# EAGLE design unijoysticle (EAGLE 7.7.0)
CNAME: Retro Moe; CREVISION: 0.4.1; DESIGNER: Ricardo Quesada
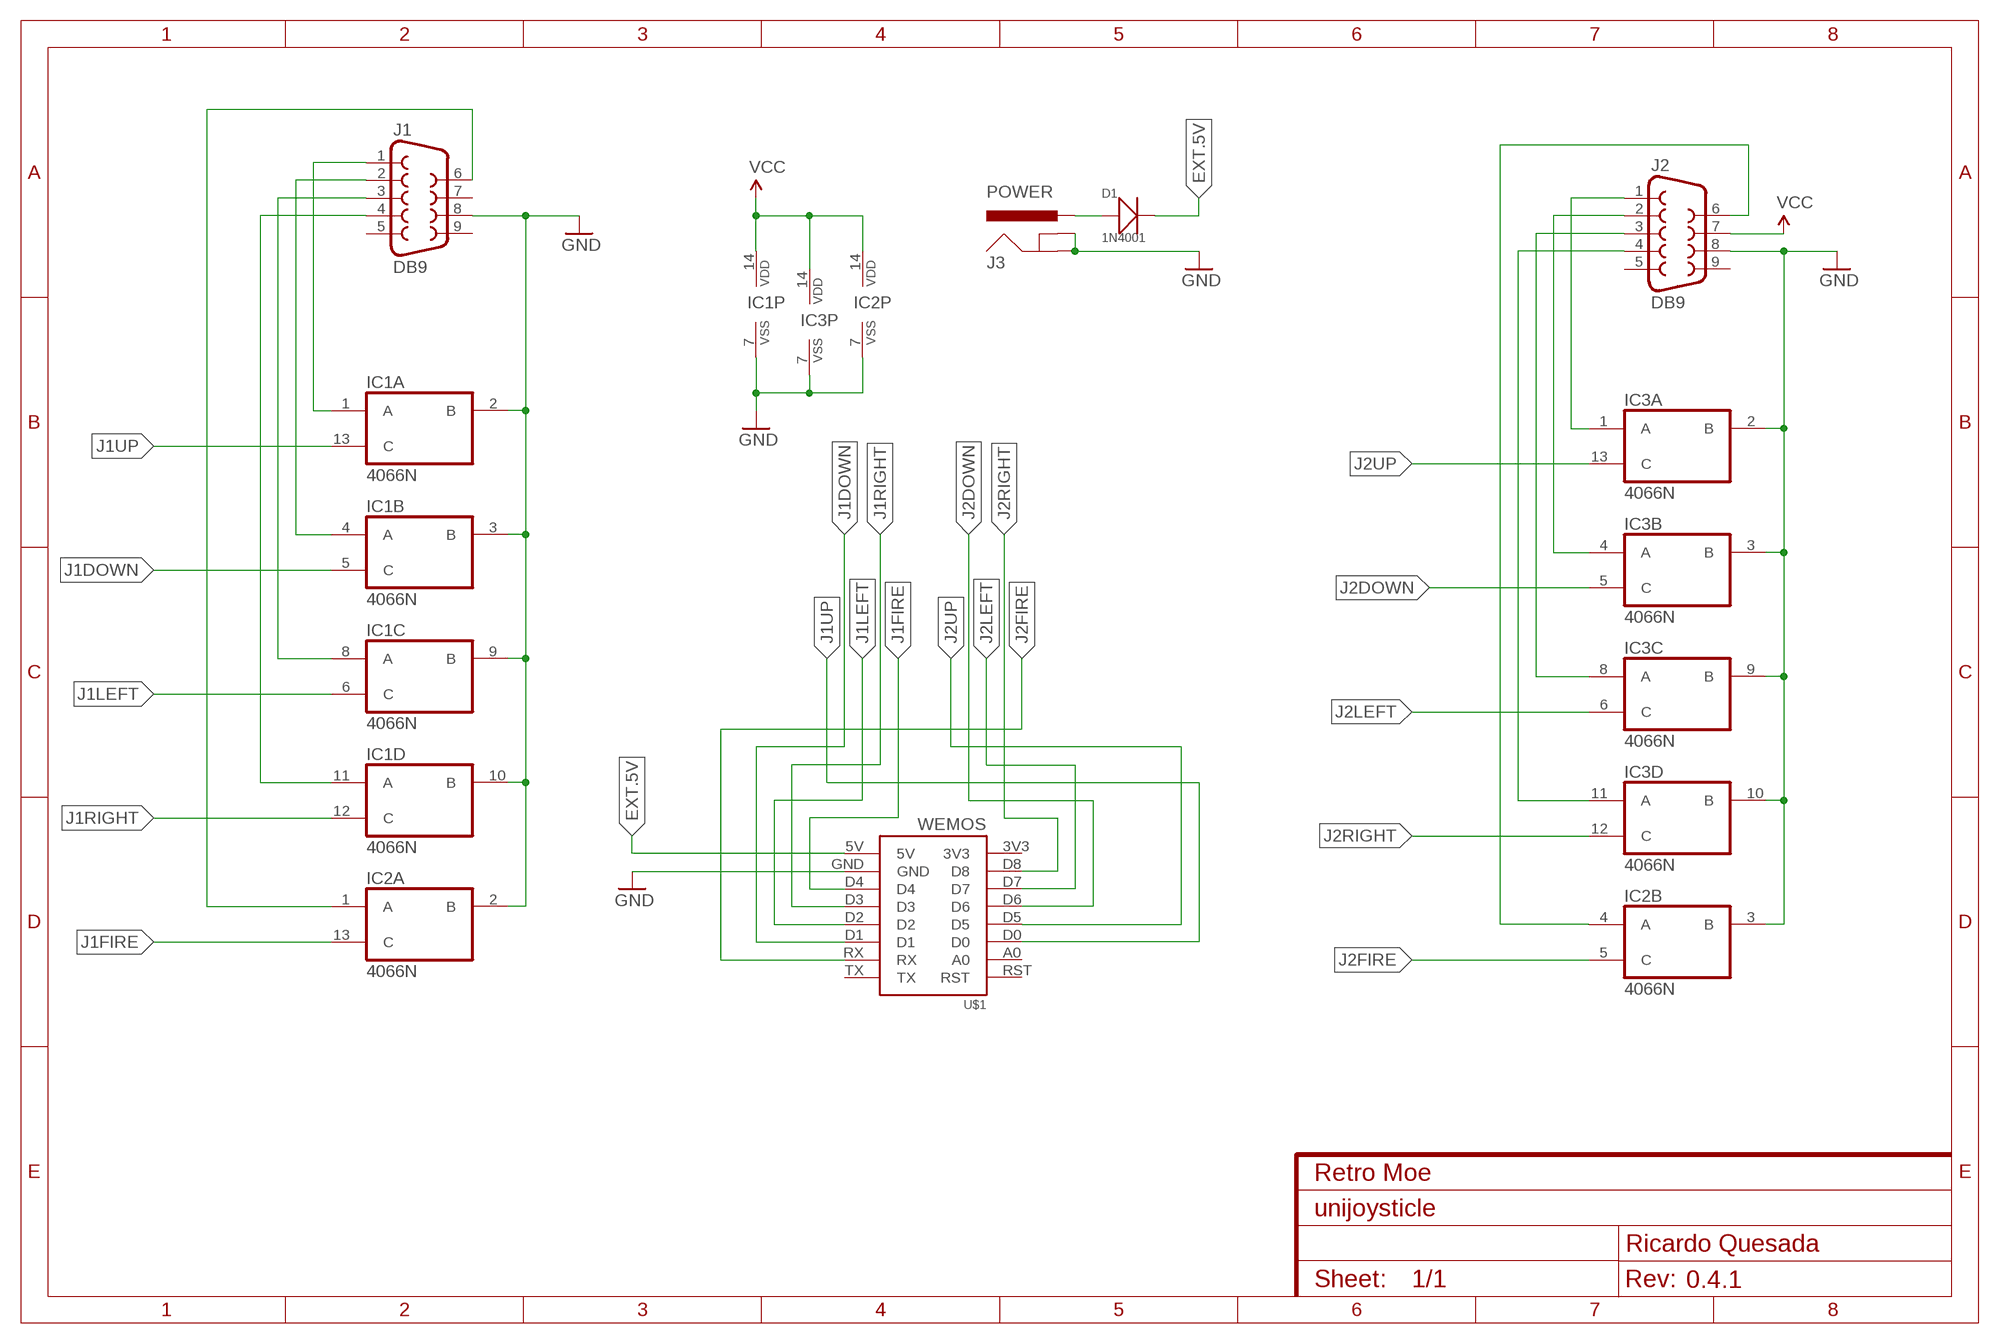
[diagram p0: schematic, sheet 1]

## Parts
D1  1N4001  DIP-DIODE-50V-1A-1N4001(DO-41)  [DO-41]
IC1  4066N  [DIL14]
IC2  4066N  [DIL14]
IC3  4066N  [DIL14]
J1  DB9  DB9FEMALE  [DB9]
J2  DB9  DB9FEMALE  [DB9]
J3  POWER  POWER_JACKSLT  [POWER_JACK_SLOT]
U$1  WEMOS  [WEMOS]

## Nets
EXT.5V: D1.2(-) U$1.5V
GND: IC1.2(A:B) IC1.3(B:B) IC1.7(P:VSS) IC1.9(C:B) IC1.10(D:B) IC2.2(A:B) IC2.3(B:B) IC2.7(P:VSS) IC3.2(A:B) IC3.3(B:B) IC3.7(P:VSS) IC3.9(C:B) IC3.10(D:B) J1.8 J2.8 J3.GND@1(GNDBREAK) J3.GND@2(GND) U$1.GND
J1DOWN: IC1.5(B:C) U$1.D1
J1FIRE: IC2.13(A:C) U$1.D4
J1LEFT: IC1.6(C:C) U$1.D2
J1RIGHT: IC1.12(D:C) U$1.D3
J1UP: IC1.13(A:C) U$1.D0
J2DOWN: IC3.5(B:C) U$1.D6
J2FIRE: IC2.5(B:C) U$1.RX
J2LEFT: IC3.6(C:C) U$1.D7
J2RIGHT: IC3.12(D:C) U$1.D8
J2UP: IC3.13(A:C) U$1.D5
N$1: D1.1(+) J3.PWR
N$9: IC1.1(A:A) J1.1
N$10: IC1.4(B:A) J1.2
N$11: IC1.8(C:A) J1.3
N$12: IC1.11(D:A) J1.4
N$13: IC3.1(A:A) J2.1
N$14: IC3.4(B:A) J2.2
N$15: IC3.8(C:A) J2.3
N$16: IC3.11(D:A) J2.4
N$21: IC2.1(A:A) J1.6
N$22: IC2.4(B:A) J2.6
VCC: IC1.14(P:VDD) IC2.14(P:VDD) IC3.14(P:VDD) J2.7
Unconnected: IC2.6(C:C) IC2.8(C:A) IC2.9(C:B) IC2.10(D:B) IC2.11(D:A) IC2.12(D:C) J1.5 J1.7 J1.9 J2.5 J2.9 U$1.3V3 U$1.A0 U$1.RST U$1.TX

## Library data of the parts
D1 = Seeed-OPL-Diode:DIP-DIODE-50V-1A-1N4001(DO-41): 304010006; MPN: 1N4001
IC1-IC3 = 40xx:4066: Quad bilateral ANALOG SWITCH; MF: TEXAS INSTRUMENTS; MPN: SN74HC4066N; OC_NEWARK: 76C3574
J1 J2 = riq-connectors:DB9: DB9 Connector Standard DB9 (D-Sub 9) serial connector. Can be used for CAN bus as well as RS485 and RS232. Footprint production proven. Spark Fun Electronics SKU : PRT-00429; MPN: 618009231121; OC_NEWARK: 16T0655; PROD_ID: CONN-08194
J3 = SparkFun-Connectors:POWER_JACK: Power Jack This is the standard 5.5mm barrel jack for power. The PTH is the most common, proven, reliable, footprint. The Slot footprint only works if the mill layer is transmitted to the PCB fab house so be warned. Mating wall wart : TOL-00298 (and others); PROD_ID: PRT-00119
U$1 = 1455413453956-wemos:WEMOS

## Net classes
0 default: width 0.305 mm, drill 0.508 mm, clearance 0.254 mm
1 PWR5: width 0.305 mm, drill 0.508 mm, clearance 0.254 mm

## Board
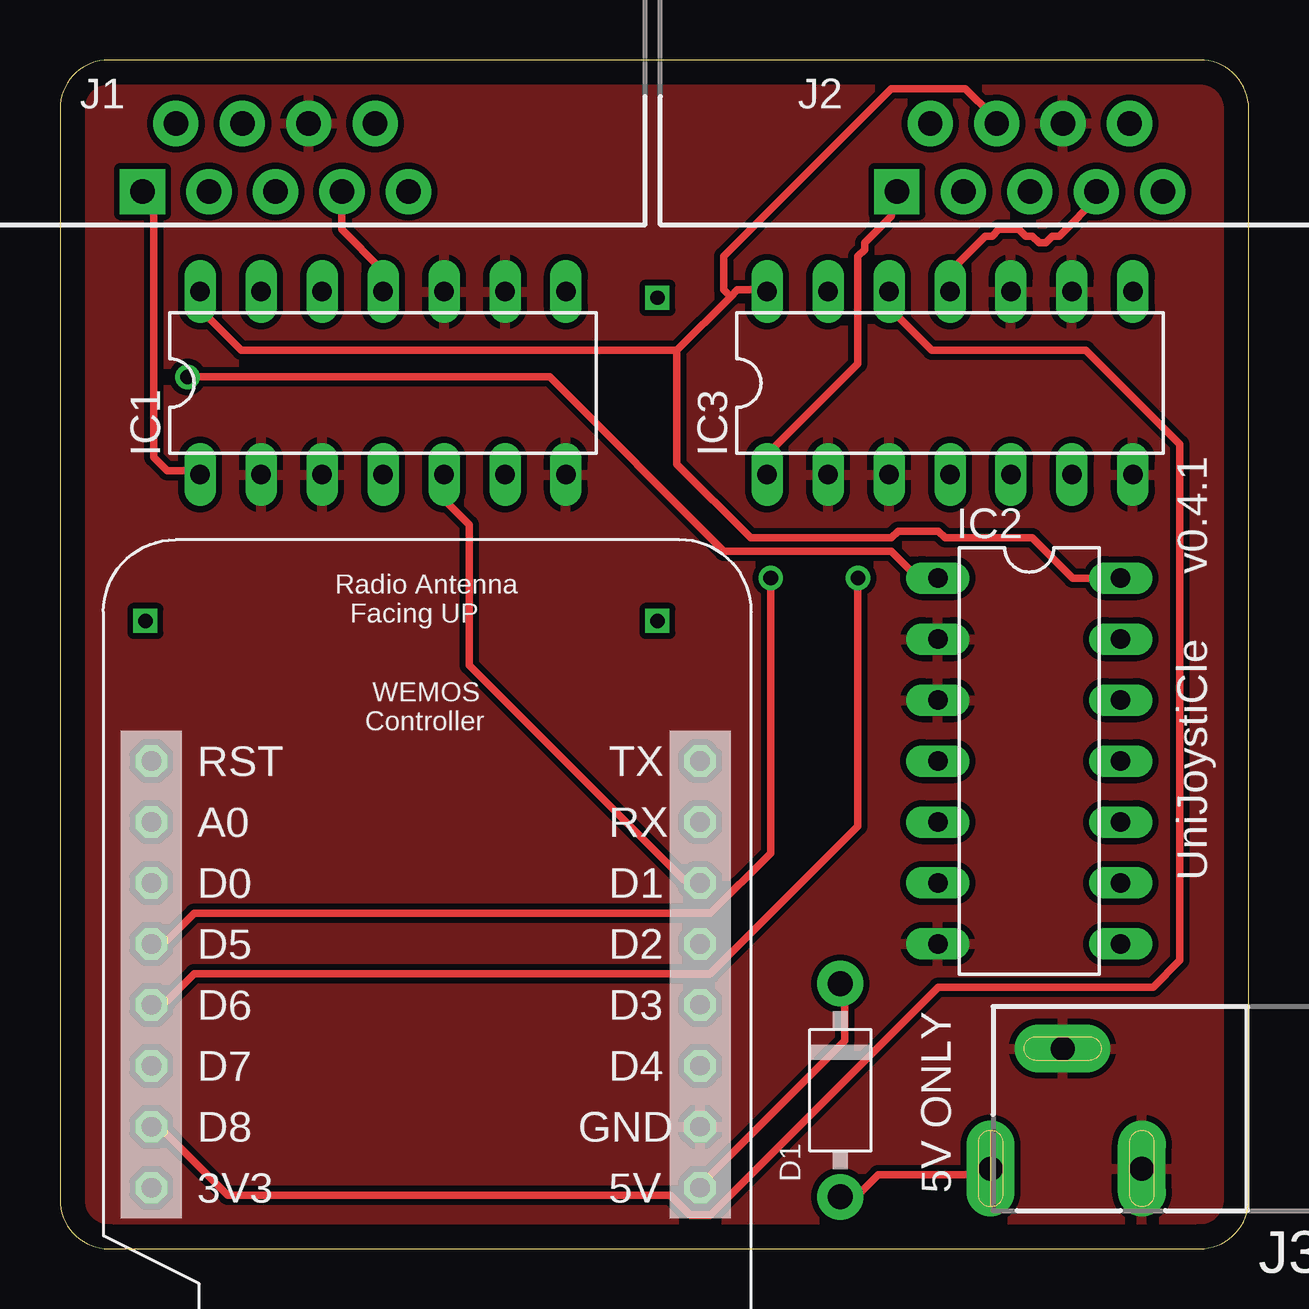
[diagram p1: board, top side]
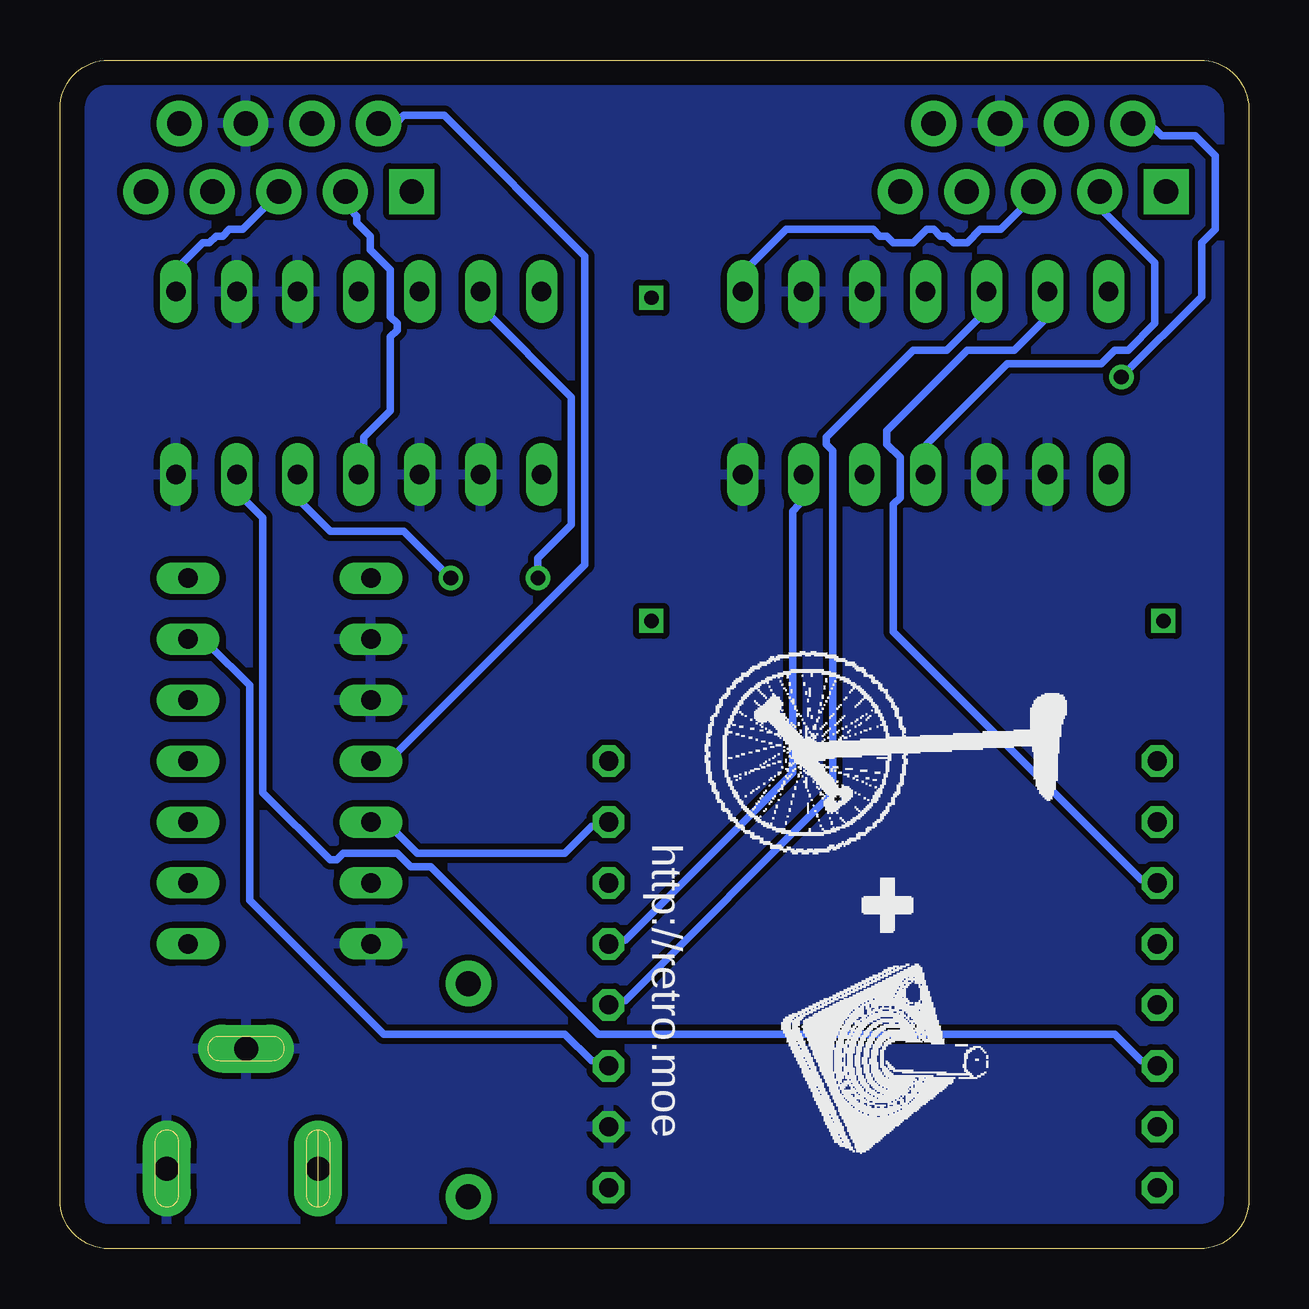
[diagram p2: board, bottom side, seen from below]

Size 49.53 x 49.53 mm. Coordinates in mm from the lower left corner, seen from the top.
Outline: 0,47.5 0,2.03 arc90 2.03,0 47.5,0 arc90 49.53,2.03 49.53,47.5 arc90 47.5,49.53 2.03,49.53 arc90 0,47.5
Copper layers (1*16): Top 0.035mm / dielectric 1.5mm / Bottom 0.035mm
Design rules "default": minimum track width 10mil, minimum drill 24mil, track to track 8mil, track to pad 8mil, pad to pad 8mil, via to via 8mil, smd to smd 8mil, copper to edge 40mil, drill to drill 8mil, minimum pad ring 10mil, minimum via ring 8mil, stop-mask expansion 4mil, vias tented up to drill 0mil, thermal gap 10mil

### Footprints (pad centres in the part's own frame; a part is rotated, then mirrored left to right if it is on the bottom)
DO-41 = drill 1.041 pad 1.905: 1 -4.445,0; 2 4.445,0
DIL14 = drill 0.813 long: 1 -7.62,-3.81; 2 -5.08,-3.81; 3 -2.54,-3.81; 4 0,-3.81; 5 2.54,-3.81; 6 5.08,-3.81; 7 7.62,-3.81; 8 7.62,3.81; 9 5.08,3.81; 10 2.54,3.81; 11 0,3.81; 12 -2.54,3.81; 13 -5.08,3.81; 14 -7.62,3.81
DB9 = drill 1.016 pad 1.88 square: 1 -5.54,-1.42 | drill 1.016 pad 1.88: 2 -2.77,-1.42; 3 0,-1.42; 4 2.77,-1.42; 5 5.54,-1.42; 6 -4.15,1.42; 7 -1.38,1.42; 8 1.38,1.42; 9 4.15,1.42
POWER_JACK_SLOT = drill 1 pad 2 long: GND@1 2.58,7.5; GND@2 7.58,10.8; PWR 2.58,13.8
WEMOS = drill 0.8 octagon: 3V3 0,0; 5V 22.86,0; A0 0,15.24; D0 0,12.7; D1 22.86,12.7; D2 22.86,10.16; D3 22.86,7.62; D4 22.86,5.08; D5 0,10.16; D6 0,7.62; D7 0,5.08; D8 0,2.54; GND 22.86,2.54; RST 0,17.78; RX 22.86,15.24; TX 22.86,17.78

### Placement (x,y rotation side)
D1  32.51,6.6 90 top
IC1  13.46,36.07 0 top
IC2  40.39,20.32 270 top
IC3  37.08,36.07 0 top
J1  8.98,45.47 0 top
J2  40.41,45.47 0 top
J3  52.58,0.76 90 top
U$1  3.81,2.54 0 top

### Tracks (layer width: path | path; a pad name or v marks a point on that pad's centre or on a via)
EXT.5V
  Top 0.305: U$1.5V 26.82,2.79 32.69,8.66 32.69,10.9 D1.2
GND
  pour Top (isolate 0.012): 47.5,0 2.03,0 arc-90 0,2.03 0,47.5 arc-90 2.03,49.53 47.5,49.53 arc-90 49.53,47.5 49.53,2.03 arc-90
  pour Bottom (isolate 0.012): 47.5,0 2.03,0 arc-90 0,2.03 0,47.5 arc-90 2.03,49.53 47.5,49.53 arc-90 49.53,47.5 49.53,2.03 arc-90
J1DOWN
  Top 0.305: U$1.D1 26.54,15.37 25.98,15.37 17.04,24.31 17.04,30.18 16.2,31.01 16.2,32.13 IC1.5
J1FIRE
  Bottom 0.305: U$1.D4 26.82,7.82 27.38,7.82 28.5,8.94 36.04,8.94 41.63,14.53 41.63,23.47 43.31,25.15 44.15,25.15 IC2.13
J1LEFT
  Bottom 0.305: U$1.D2 26.54,12.85 25.98,12.85 19,19.84 19,30.73 18.72,31.01 18.72,32.13 IC1.6
J1RIGHT
  Bottom 0.305: U$1.D3 26.54,10.34 25.98,10.34 17.32,19 17.32,33.25 17.6,33.53 17.6,33.81 13.97,37.44 12.57,37.44 11.18,38.84 11.18,39.67 IC1.12
J1UP
  Bottom 0.305: IC1.13 8.38,38.84 9.78,37.44 11.73,37.44 15.09,34.09 15.09,33.53 14.53,32.97 14.53,31.29 14.81,31.01 14.81,25.7 4.47,15.37 3.91,15.37 U$1.D0
J2DOWN  (via drill 0.61)
  Top 0.305: v33.25,27.94 33.25,17.6 27.1,11.46 5.59,11.46 4.47,10.34 3.91,10.34 U$1.D6
  Bottom 0.305: v33.25,27.94 35.2,29.9 38.28,29.9 39.4,31.01 39.4,32.13 IC3.5
J2FIRE
  Bottom 0.305: U$1.RX 26.82,17.6 27.38,17.6 28.5,16.48 34.65,16.48 35.76,17.6 36.32,17.6 IC2.5
J2LEFT
  Bottom 0.305: U$1.D7 3.91,7.82 4.47,7.82 5.59,8.94 27.1,8.94 34.09,15.93 34.92,15.93 35.48,16.48 37.72,16.48 38,16.2 38.28,16.2 41.07,19 41.07,30.45 41.91,31.29 41.91,32.13 IC3.6
J2RIGHT
  Top 0.305: U$1.D8 3.91,5.03 4.19,5.03 6.99,2.23 25.43,2.23 26.26,1.4 27.1,1.4 36.6,10.9 45.54,10.9 46.66,12.01 46.66,33.53 42.75,37.44 36.32,37.44 34.65,39.12 34.65,39.67 IC3.12
J2UP  (via drill 0.61)
  Top 0.305: v29.62,27.94 29.62,16.48 27.1,13.97 5.59,13.97 4.47,12.85 3.91,12.85 U$1.D5
  Bottom 0.305: v29.62,27.94 29.62,28.78 28.22,30.18 28.22,35.48 31.85,39.12 31.85,39.67 IC3.13
N$1
  Top 0.305: D1.1 32.69,2.23 33.25,2.23 34.09,3.07 38.56,3.07 J3.PWR
N$2  (via drill 0.6)
  other vias: 3.56,26.16
N$3  (via drill 0.6)
  other vias: 24.89,39.62
N$4  (via drill 0.6)
  other vias: 24.89,26.16
N$9
  Top 0.305: IC1.1 5.59,32.41 4.47,32.41 3.91,32.97 3.91,43.59 3.63,43.87 J1.1
N$10
  Bottom 0.305: IC1.4 13.41,32.41 13.41,33.53 10.06,36.88 6.15,36.88 5.59,37.44 5.03,37.44 3.91,38.56 3.91,41.07 6.15,43.31 6.15,43.87 J1.2
N$11
  Bottom 0.305: IC1.8 20.95,39.95 20.95,40.79 19.28,42.47 15.65,42.47 15.37,42.19 15.09,42.19 14.81,41.91 13.97,41.91 13.41,42.47 13.13,42.47 12.85,42.19 12.57,42.19 12.29,41.91 11.73,41.91 11.18,42.47 10.34,42.47 8.94,43.87 J1.3
N$12
  Top 0.305: IC1.11 13.41,39.95 13.41,40.79 11.73,42.47 11.73,43.87 J1.4
N$13
  Top 0.305: IC3.1 29.62,32.41 29.62,33.25 33.25,36.88 33.25,41.35 33.53,41.63 33.53,41.91 34.65,43.03 34.65,43.87 J2.1
N$14
  Bottom 0.305: IC3.4 36.88,32.41 36.88,33.81 35.76,34.92 35.76,38 35.48,38.28 35.48,38.56 35.76,38.84 35.76,40.79 36.6,41.63 36.6,42.19 37.16,42.75 37.16,43.03 37.44,43.31 37.44,43.87 J2.2
N$15
  Bottom 0.305: IC3.8 44.7,40.79 43.59,41.91 43.31,41.91 43.03,42.19 42.75,42.19 42.47,42.47 41.91,42.47 40.51,43.87 J2.3
N$16
  Top 0.305: IC3.11 37.16,39.95 37.16,40.79 38.56,42.19 38.84,42.19 39.12,42.47 39.95,42.47 40.23,42.19 40.51,42.19 40.79,41.91 41.07,41.91 41.35,42.19 41.63,42.19 43.31,43.87 J2.4
N$21  (via drill 0.61)
  Top 0.305: IC2.1 35.76,27.94 34.65,29.06 27.66,29.06 20.4,36.32 v5.31,36.32
  Bottom 0.305: v5.31,36.32 1.96,39.67 1.96,41.91 1.4,42.47 1.4,45.54 2.23,46.38 3.63,46.38 3.91,46.66 4.75,46.66 J1.6
N$22
  Bottom 0.305: IC2.4 36.32,20.4 35.76,20.4 27.66,28.5 27.66,41.35 33.53,47.22 35.2,47.22 35.48,46.94 36.04,46.94 J2.6
VCC
  Top 0.305: 25.7,37.44 7.54,37.44 5.87,39.12 5.87,39.67 IC1.14 | 27.94,39.67 28.22,39.95 29.34,39.95 IC3.14 | 27.94,39.67 25.7,37.44 | IC2.14 42.19,27.94 40.51,29.62 36.88,29.62 36.6,29.9 34.92,29.9 34.65,29.62 28.78,29.62 25.7,32.69 25.7,37.44 | 27.94,39.67 27.66,39.95 27.66,41.35 34.65,48.34 37.72,48.34 38.84,47.22 38.84,46.94 J2.7

### Text on the board
tPlace: UniJoystiCle | 5V ONLY
bPlace: http://retro.moe